# Altium schematic sheet DDR5_System_Connector.SchDoc
size A4; MPS_Contact: www.monolithicpower.com
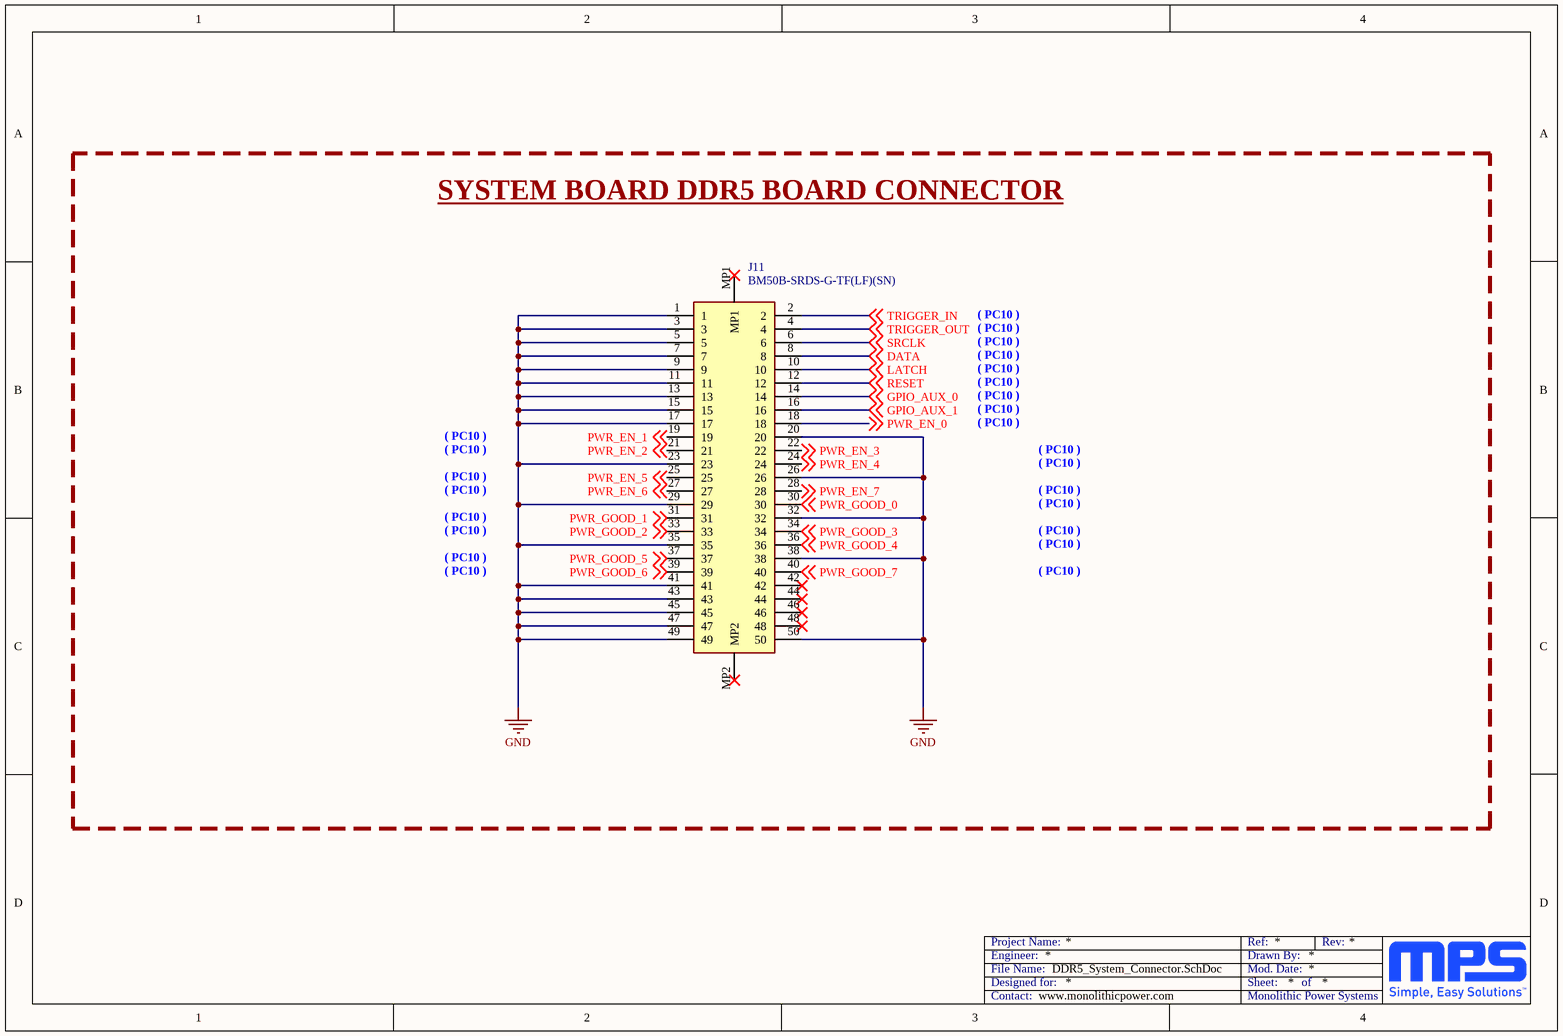
[diagram p0: DDR5_System_Connector.SchDoc]

## Parts
J11  BM50B-SRDS-G-TF(LF)(SN)  [BM50BSRDSGTFLFSN]

## Blocks framed on the sheet
SYSTEM BOARD DDR5 BOARD CONNECTOR: J11

## Nets
GND: J11.1 J11.3 J11.5 J11.7 J11.9 J11.11 J11.13 J11.15 J11.17 J11.20 J11.23 J11.26 J11.29 J11.32 J11.35 J11.38 J11.41 J11.43 J11.45 J11.47 J11.49 J11.50
DATA: J11.8 ; off-sheet DATA
GPIO_AUX_0: J11.14 ; off-sheet GPIO_AUX_0
GPIO_AUX_1: J11.16 ; off-sheet GPIO_AUX_1
LATCH: J11.10 ; off-sheet LATCH
PWR_EN_0: J11.18 ; off-sheet PWR_EN_0
PWR_EN_1: J11.19 ; off-sheet PWR_EN_1
PWR_EN_2: J11.21 ; off-sheet PWR_EN_2
PWR_EN_3: J11.22 ; off-sheet PWR_EN_3
PWR_EN_4: J11.24 ; off-sheet PWR_EN_4
PWR_EN_5: J11.25 ; off-sheet PWR_EN_5
PWR_EN_6: J11.27 ; off-sheet PWR_EN_6
PWR_EN_7: J11.28 ; off-sheet PWR_EN_7
PWR_GOOD_0: J11.30 ; off-sheet PWR_GOOD_0
PWR_GOOD_1: J11.31 ; off-sheet PWR_GOOD_1
PWR_GOOD_2: J11.33 ; off-sheet PWR_GOOD_2
PWR_GOOD_3: J11.34 ; off-sheet PWR_GOOD_3
PWR_GOOD_4: J11.36 ; off-sheet PWR_GOOD_4
PWR_GOOD_5: J11.37 ; off-sheet PWR_GOOD_5
PWR_GOOD_6: J11.39 ; off-sheet PWR_GOOD_6
PWR_GOOD_7: J11.40 ; off-sheet PWR_GOOD_7
RESET: J11.12 ; off-sheet RESET
SRCLK: J11.6 ; off-sheet SRCLK
TRIGGER_IN: J11.2 ; off-sheet TRIGGER_IN
TRIGGER_OUT: J11.4 ; off-sheet TRIGGER_OUT

Not connected (* = marked no-connect by the designer): J11 42* 44* 46* 48* MP1* MP2*

## Notes on the sheet
- ( PC10 )
- Engineer:
- Designed for:
- File Name:
- Project Name:
- Mod. Date:
- Sheet:
- Drawn By:
- Ref:
- of
- Rev:
- Contact:
- Monolithic Power Systems

## Library data of the parts
J11 = BM50B-SRDS-G-TF(LF)(SN): Manufacturer: JST; DrownBy: Xavier Rocher; Datasheet: https://www.farnell.com/datasheets/2085439.pdf?_gl=1*149c80b*_gcl_aw*R0NMLjE3NzI0MzkxNjIuQ2p3S0NBaUFoNVhOQmhBQUVpd0FfQnU4RlZpZGN3SFZkTmhUaGpab0lwT1FoQkFLZGxhWW9IVVdZQjN2WlhqdGU5dFd2US1sQTZFMy14b0NDLUVRQXZEX0J3RQ..*_gcl_au*MjEwMjY0Mzg0MC4xNzcyNDM5MTYx; Package: BM50B Series; Supplier 1: Farnell; Supplier  Part Number 1: 2399332; Supplier 2: Mouser; Supplier  Part Number 2: 306-BM50BSRDSGTFLFSN; Manufacturer Part Number: BM50B-SRDS-G-TF(LF)(SN); Value: BM50B-SRDS-G-TF(LF)(SN)